# Altium project UWAAL Telemetry Board.PrjPcb
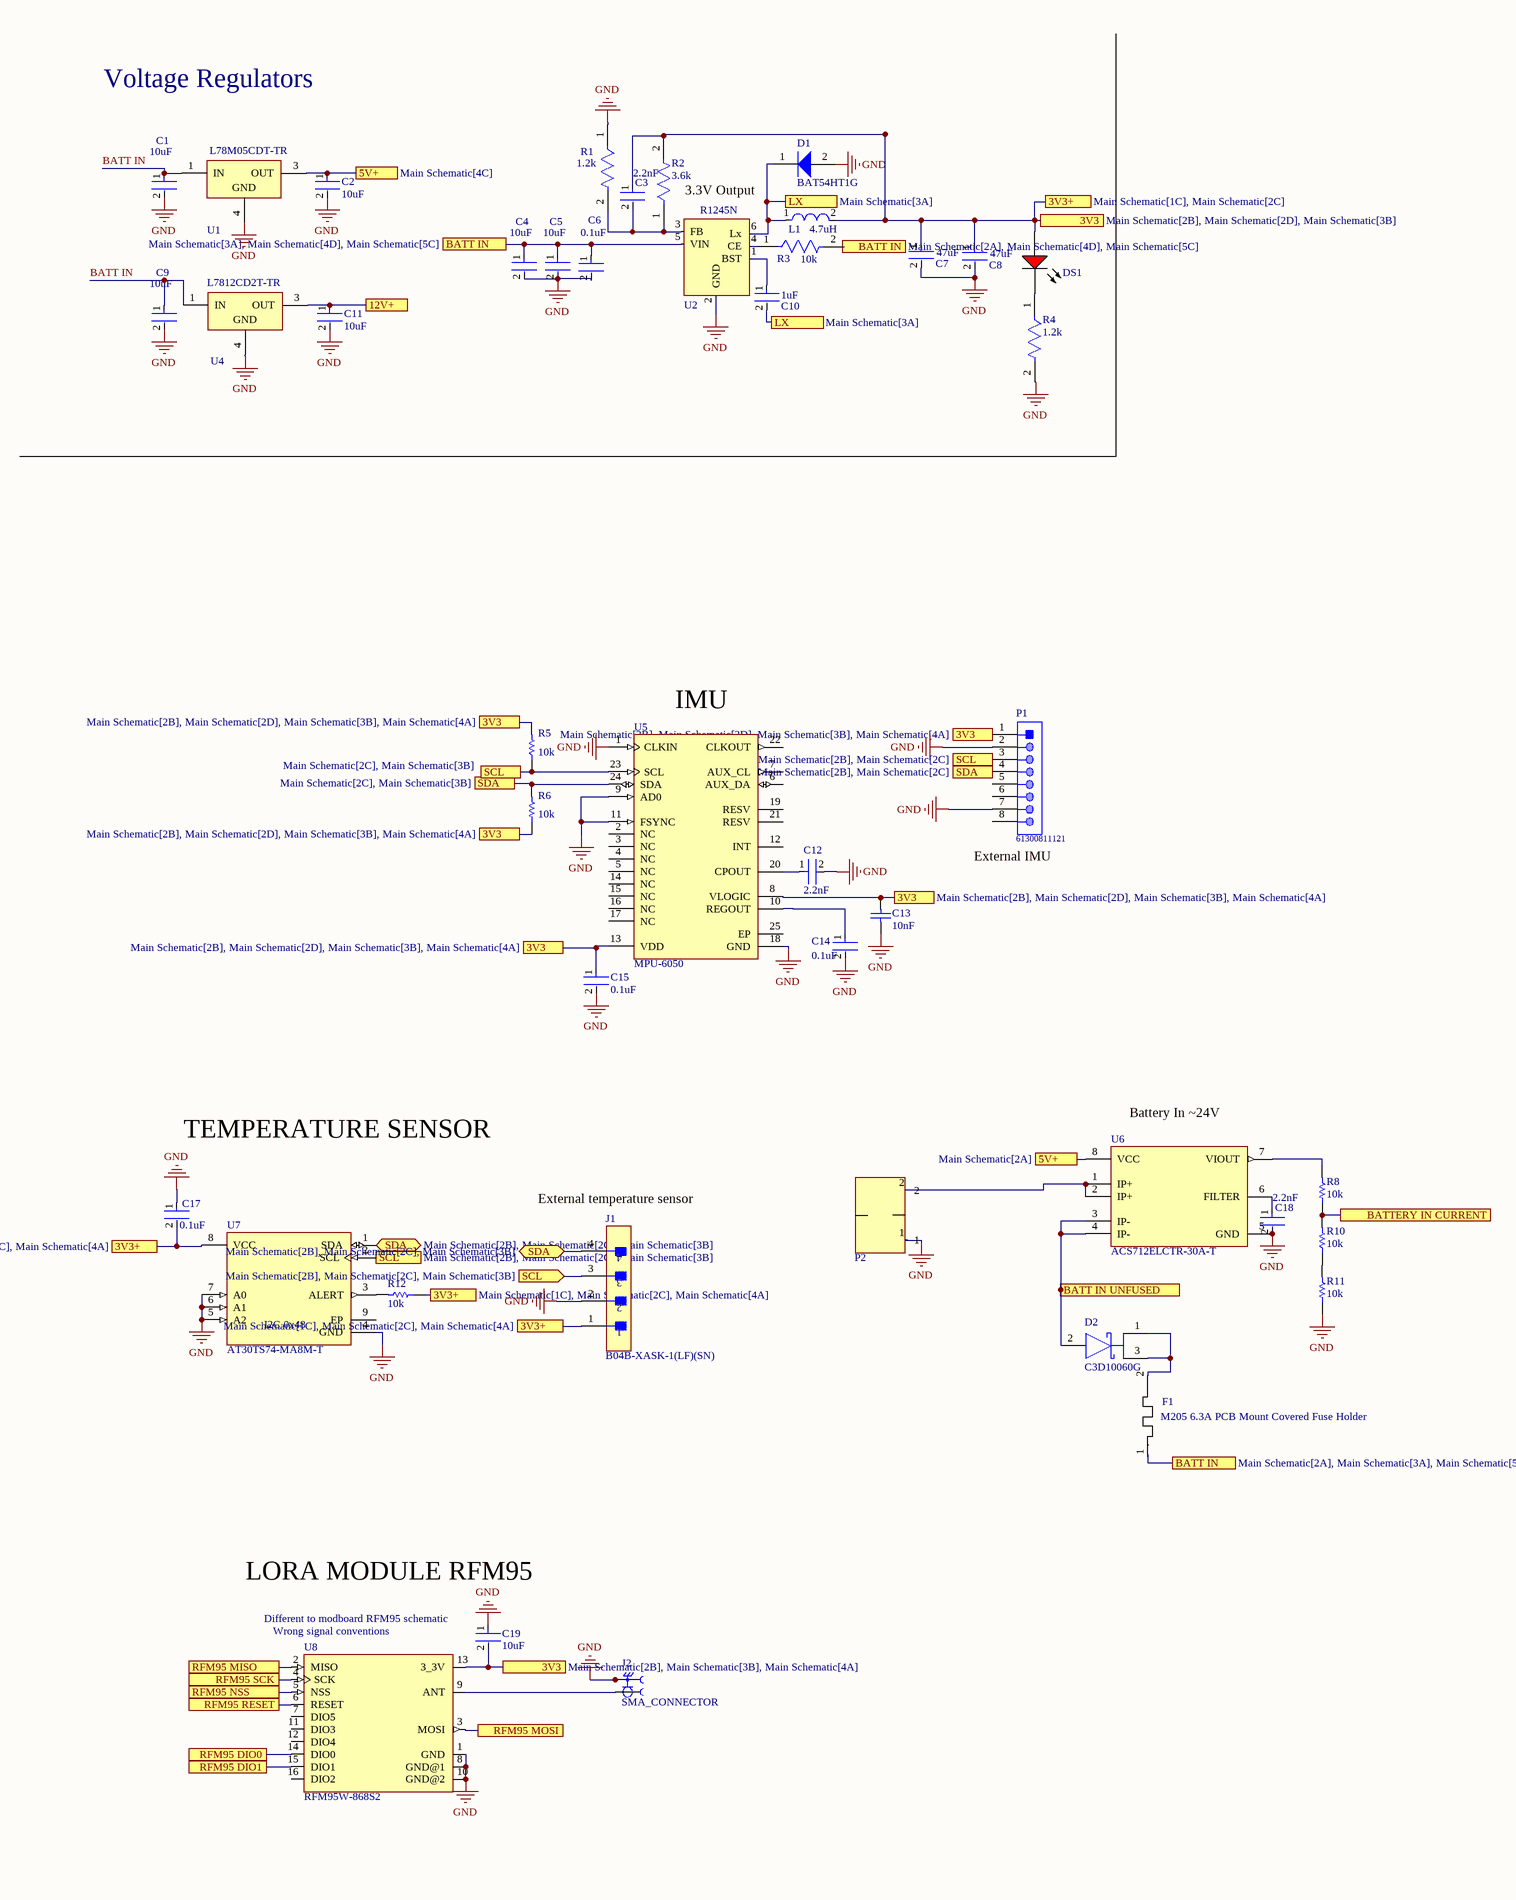
[diagram p0: Main Schematic.SchDoc, left]
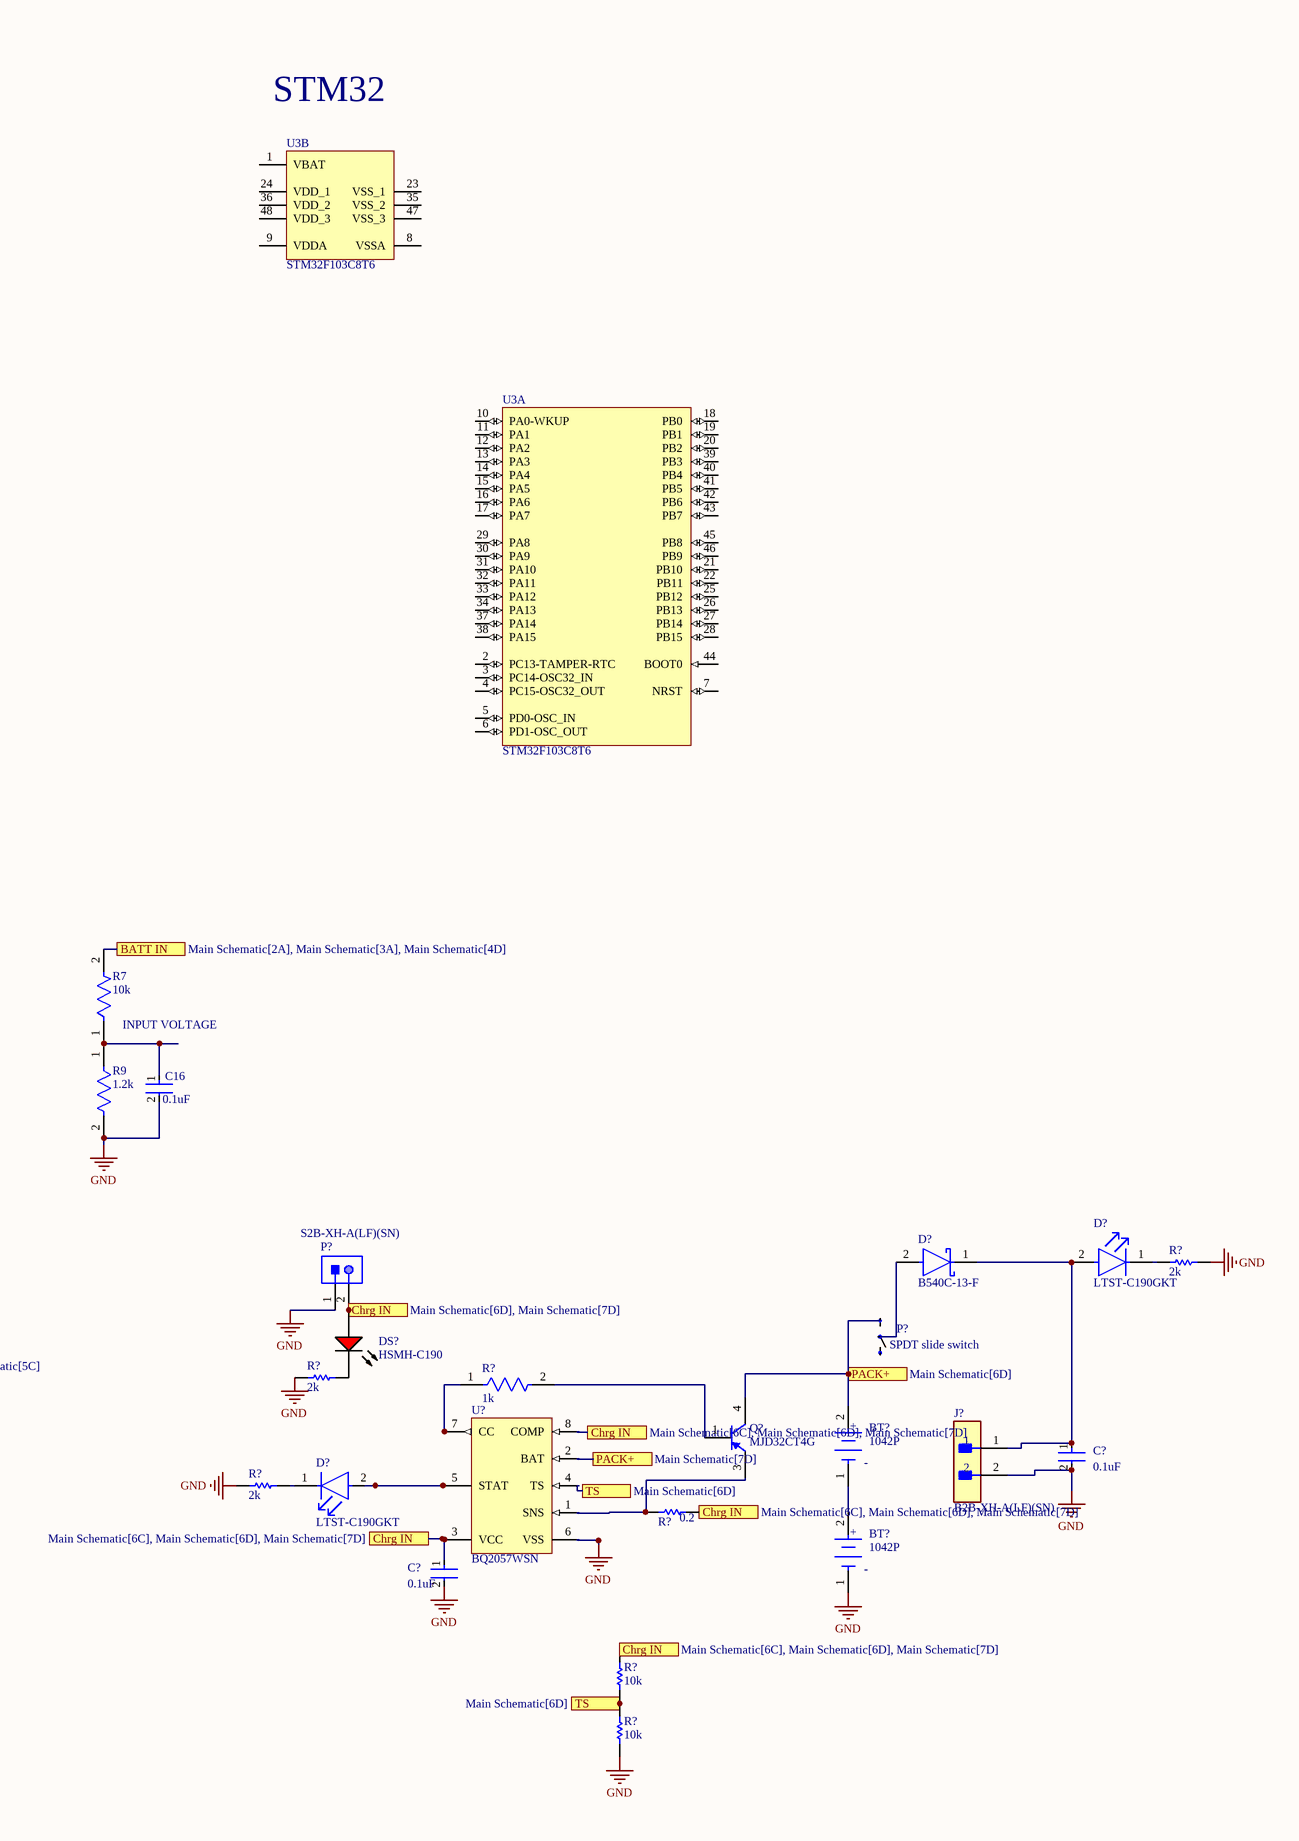
[diagram p1: Main Schematic.SchDoc, right]
1 sheet, 68 parts. Net scope: flat (ports and power ports of the same name join across sheets).
Board file: Main PCB.PcbDoc

## Sheet Main Schematic.SchDoc
size A2; SheetNumber: 1; SheetTotal: 1

### Parts
(Parts that share a designator on the sheet are numbered #1, #2 ... from top to bottom, then left to right.)
BT?#1  1042P  [FP-1042P-MFG]
BT?#2  1042P  [FP-1042P-MFG]
C1  10uF  [FP-2220-L_5_7_0_5-W_5_0_4-IPC_A]
C2  10uF  [FP-GRM188-0_2-MFG]
C3  2.2nF  [FP-0603-L_1_6_0_15-W_0_81-IPC_C]
C4  10uF  [FP-2220-L_5_7_0_5-W_5_0_4-IPC_A]
C5  10uF  [FP-2220-L_5_7_0_5-W_5_0_4-IPC_A]
C6  0.1uF  [FP-C0603-CJ-MFG]
C7  47uF  [FP-C0805C476M9PACTU-MFG]
C8  47uF  [FP-C0805C476M9PACTU-MFG]
C9  10uF  [FP-2220-L_5_7_0_5-W_5_0_4-IPC_A]
C10  1uF  [FP-0603-L_1_6_0_1-W_0_8_0-IPC_A]
C11  10uF  [FP-GRM188-0_2-MFG]
C12  2.2nF  [FP-0603-L_1_6_0_15-W_0_81-IPC_C]
C13  10nF  [CAPC1608X90X35ML10T15]
C14  0.1uF  [FP-C0603C-CF-MFG]
C15  0.1uF  [FP-C0603C-CF-MFG]
C16  0.1uF  [FP-C0603-CJ-MFG]
C17  0.1uF  [FP-C0603-CJ-MFG]
C18  2.2nF  [FP-0603-L_1_6_0_15-W_0_81-IPC_C]
C19  10uF  [FP-GRM188-0_1-e0_2_0_55-IPC_A]
C?#1  0.1uF  [FP-C0603C-CF-MFG]
C?#2  0.1uF  [FP-C0603C-CF-MFG]
D1  BAT54HT1G  [ONSC-SOD-323-2-477-02_V]
D2  C3D10060G  [FP-TO-263-2_v1-MFG]
D?#1  B540C-13-F  [FP-SMC-MFG]
D?#2  LTST-C190GKT  [FP-LTST-C190GKT-MFG]
D?#3  LTST-C190GKT  [FP-LTST-C190GKT-MFG]
DS1  TLMS1000-GS08  [VISH-TLMS1000_V]  (value not drawn)
DS?  HSMH-C190  [AVAG-HSMX-C190_V]
F1  M205 6.3A PCB Mount Covered Fuse Holder  [M205 6.3A PCB Mount Covered Fuse Holder-Footprint-1]
J1  B04B-XASK-1(LF)(SN)  [FP-B04B-XASK-1_LF_SN-MFG]
J2  SMA_CONNECTOR  [LPRS_SMA_CONNECTOR]
J?  B2B-XH-A(LF)(SN)  [FP-B2B-XH-A_LF_SN-MFG]
L1  4.7uH  [FP-IHLP-2525BD-FP_2_413x3-MFG]
P1  61300811121  [61300811121]
P2  Barrier Block Screw Terminal 2 Way  [Barrier Block Screw Terminal 2 Way-Footprint-1]  (value not drawn)
P?#1  S2B-XH-A(LF)(SN)  [JST-S2B-XH-A(LF)(SN)_V]
P?#2  SPDT slide switch  [Horizontal SPDT 5A slide switch-Footprint-1]
Q?  MJD32CT4G  [ONSC-DPAK-3-369C-01_V]
R1  1.2k  [FP-CRCW0603-e3-MFG]
R2  3.6k  [FP-CRCW0603-e3-IPC_A]
R3  10k  [FP-ERA3A-IPC_C]
R4  1.2k  [FP-CRCW0603-e3-MFG]
R5  10k  [RESC1609X50X30NL8T20]
R6  10k  [RESC1609X50X30NL8T20]
R7  10k  [FP-ERA3A-IPC_C]
R8  10k  [RESC1609X50X30NL8T20]
R9  1.2k  [FP-CRCW0603-e3-MFG]
R10  10k  [RESC1609X50X30NL8T20]
R11  10k  [RESC1609X50X30NL8T20]
R12  10k  [RESC1609X50X30NL8T20]
R?#1  2k  [RESC1609X50X30ML10T20]
R?#2  2k  [RESC1609X50X30ML10T20]
R?#3  1k  [FP-CRCW0603-e3-MFG]
R?#4  2k  [RESC1609X50X30ML10T20]
R?#5  0.2  [RESC3216X89X51ML25T25]
R?#6  10k  [RESC1609X50X30NL8T20]
R?#7  10k  [RESC1609X50X30NL8T20]
U1  L78M05CDT-TR  [TO-252_L]
U2  R1245N  [SOT95P280X100-6N]
U3  STM32F103C8T6  [STM-LQFP48_L]  (parts A,B of 2)
U4  L7812CD2T-TR  [TO-263_M]
U5  MPU-6050  [IS-QFN-24_V]
U6  ACS712ELCTR-30A-T  [FP-LC-8-IPC_C]
U7  AT30TS74-MA8M-T  [FP-8MA2-MFG]
U8  RFM95W-868S2  [XCVR_RFM95W-868S2]
U?  BQ2057WSN  [D0008A_N]

### Ports
3V3 (see Main Schematic[2B], Main Schematic[2D], Main Schematic[3B]), 3V3 (see Main Schematic[2B], Main Schematic[2D], Main Schematic[3B], Main Schematic[4A]), 3V3 (see Main Schematic[2B], Main Schematic[3B], Main Schematic[4A]), 3V3+ (see Main Schematic[1C], Main Schematic[2C]), 3V3+ (see Main Schematic[1C], Main Schematic[2C], Main Schematic[4A]), 3V3+ (see Main Schematic[2C], Main Schematic[4A]), 5V+ (see Main Schematic[2A]), 5V+ (see Main Schematic[4C]), 12V+, BATT IN (see Main Schematic[2A], Main Schematic[3A], Main Schematic[4D]), BATT IN (see Main Schematic[2A], Main Schematic[3A], Main Schematic[5C]), BATT IN (see Main Schematic[2A], Main Schematic[4D], Main Schematic[5C]), BATT IN (see Main Schematic[3A], Main Schematic[4D], Main Schematic[5C]), BATT IN UNFUSED, BATTERY IN CURRENT, Chrg IN (see Main Schematic[6C], Main Schematic[6D], Main Schematic[7D]), Chrg IN (see Main Schematic[6D], Main Schematic[7D]), LX (see Main Schematic[3A]), PACK+ (see Main Schematic[6D]), PACK+ (see Main Schematic[7D]), RFM95 DIO0, RFM95 DIO1, RFM95 MISO, RFM95 MOSI, RFM95 NSS, RFM95 RESET, RFM95 SCK, SCL (in, see Main Schematic[2B], Main Schematic[2C], Main Schematic[3B]), SCL (see Main Schematic[2B], Main Schematic[2C]), SCL (see Main Schematic[2C], Main Schematic[3B]), SDA (bidir, see Main Schematic[2B], Main Schematic[2C], Main Schematic[3B]), SDA (see Main Schematic[2B], Main Schematic[2C]), SDA (see Main Schematic[2C], Main Schematic[3B]), TS (see Main Schematic[6D])

### Nets
GND: BT?#2.1(C) C1.2 C2.2 C4.2 C5.2 C6.2 C7.2 C8.2 C9.2 C11.2 C12.2 C13.1 C14.2 C15.2 C16.2 C17.1 C18.2 C19.1 C?#1.2 C?#2.2 D1.2(A) J1.2 J2.G1 J2.G2 J2.G3 J2.G4 J?.2 P1.2 P1.7 P2.1 P?#1.1 R1.1 R4.2 R9.2 R11.1 R?#1.1 R?#2.1 R?#4.1 R?#7.1 U1.4(GND) U2.2(GND) U4.4(GND) U5.1(CLKIN) U5.9(AD0) U5.11(FSYNC) U5.18(GND) U6.5(GND) U7.4(GND) U7.5(A2) U7.6(A1) U7.7(A0) U8.1(GND) U8.8(GND@1) U8.10(GND@2) U?.6(VSS)
BATT IN: C1.1 C9.1 U1.1(IN) U4.1(IN)
NetBT?#1_1: BT?#1.1(C) BT?#2.2(A)
NetBT?#1_2: BT?#1.2(A) P?#2.1 Q?.4(C) U?.2(BAT) ; port PACK+
NetC2_1: C2.1 U1.3(OUT) U6.8(VCC) ; port 5V+
NetC3_1: C3.1 C7.1 C8.1 C13.2 C15.1 C17.2 C19.2 DS1.1(A) J1.1 L1.2 P1.1 R2.2 R5.2 R6.1 R12.1 U5.8(VLOGIC) U5.13(VDD) U7.8(VCC) U8.13(3_3V) ; port 3V3+, port 3V3
NetC3_2: C3.2 R1.2 R2.1 U2.3(FB)
NetC4_1: C4.1 C5.1 C6.1 F1.1 R3.2 R7.2 U2.5(VIN) ; port BATT IN
NetC10_1: C10.1 U2.1(BST)
NetC10_2: C10.2 D1.1(K) L1.1 U2.6(Lx) ; port LX
NetC11_1: C11.1 U4.3(OUT) ; port 12V+
NetC12_1: C12.1 U5.20(CPOUT)
NetC14_1: C14.1 U5.10(REGOUT)
NetC16_1: C16.1 R7.1 R9.1
NetC18_1: C18.1 U6.6(FILTER)
NetC?#1_1: C?#1.1 D?#1.1(C) D?#2.2(A) J?.1
NetC?#2_1: C?#2.1 DS?.1(A) P?#1.2 R?#5.2 R?#6.2 U?.3(VCC) U?.8(COMP) ; port Chrg IN
NetD2_1: D2.1(C) D2.3(C) F1.2
NetD2_2: D2.2(A) U6.3(IP-) U6.4(IP-) ; port BATT IN UNFUSED
NetD?#1_2: D?#1.2(A) P?#2.2
NetD?#2_1: D?#2.1(C) R?#1.2
NetD?#3_1: D?#3.1(C) R?#4.2
NetD?#3_2: D?#3.2(A) U?.5(STAT)
NetDS1_2: DS1.2(K) R4.1
NetDS?_2: DS?.2(K) R?#2.2
NetJ1_3: J1.3 P1.3 R5.1 U5.23(SCL) U7.2(SCL) ; port SCL
NetJ1_4: J1.4 P1.4 R6.2 U5.24(SDA) U7.1(SDA) ; port SDA
NetJ2_1: J2.1 U8.9(ANT)
NetP2_2: P2.2 U6.1(IP+) U6.2(IP+)
NetQ?_1: Q?.1(B) R?#3.2
NetQ?_3: Q?.3(E) R?#5.1 U?.1(SNS)
NetR3_1: R3.1 U2.4(CE)
NetR8_1: R8.1 R10.2 ; port BATTERY IN CURRENT
NetR8_2: R8.2 U6.7(VIOUT)
NetR10_1: R10.1 R11.2
NetR12_2: R12.2 U7.3(ALERT)
NetR?#3_1: R?#3.1 U?.7(CC)
NetR?#6_1: R?#6.1 R?#7.2 U?.4(TS) ; port TS
NetU8_2: U8.2(MISO) ; port RFM95 MISO
NetU8_3: U8.3(MOSI) ; port RFM95 MOSI
NetU8_4: U8.4(SCK) ; port RFM95 SCK
NetU8_5: U8.5(NSS) ; port RFM95 NSS
NetU8_6: U8.6(RESET) ; port RFM95 RESET
NetU8_14: U8.14(DIO0) ; port RFM95 DIO0
NetU8_15: U8.15(DIO1) ; port RFM95 DIO1

Not connected (* = marked no-connect by the designer): P1 5 6 8; P?#2 3(16); U3 1(VBAT) 2(PC13-TAMPER-RTC) 3(PC14-OSC32_IN) 4(PC15-OSC32_OUT) 5(PD0-OSC_IN) 6(PD1-OSC_OUT) 7(NRST) 8(VSSA) 9(VDDA) 10(PA0-WKUP) 11(PA1) 12(PA2) 13(PA3) 14(PA4) 15(PA5) 16(PA6) 17(PA7) 18(PB0) 19(PB1) 20(PB2) 21(PB10) 22(PB11) 23(VSS_1) 24(VDD_1) 25(PB12) 26(PB13) 27(PB14) 28(PB15) 29(PA8) 30(PA9) 31(PA10) 32(PA11) 33(PA12) 34(PA13) 35(VSS_2) 36(VDD_2) 37(PA14) 38(PA15) 39(PB3) 40(PB4) 41(PB5) 42(PB6) 43(PB7) 44(BOOT0) 45(PB8) 46(PB9) 47(VSS_3) 48(VDD_3); U5 2(NC) 3(NC) 4(NC) 5(NC) 6(AUX_DA) 7(AUX_CL) 12(INT) 14(NC) 15(NC) 16(NC) 17(NC) 19(RESV) 21(RESV) 22(CLKOUT) 25(EP); U7 9(EP); U8 7(DIO5) 11(DIO3) 12(DIO4) 16(DIO2)

### Notes on the sheet
- Voltage Regulators
- 3.3V Output
- STM32
- (near U5) IMU
- (near P1) External IMU
- (near U5) I2C 0x68
- TEMPERATURE SENSOR
- (near U6) Battery In ~24V
- (near R7) INPUT VOLTAGE
- (near J1) External temperature sensor
- (near U7) I2C 0x48
- (near C19) LORA MODULE RFM95
- (near C19) Different to modboard RFM95 schematic
- (near U8) Wrong signal conventions
- (in symbol CMP-19636-000019-1) +; -

### Library data of the parts
BT?#1 BT?#2 = CMP-19636-000019-1: BATTERY HOLDER 18650 SMD TAB; Number of Cells: 1; Max Operating Temperature: 145°C; Termination: SMD/SMT; Mount: Surface Mount; Min Operating Temperature: -50°C; Package Quantity: 200; Packaging: Tray; Lead Free: Lead Free
C1 C4 C5 C9 = CMP-04427-001477-1: General Purpose Ceramic Capacitor, 2220, 10uF, 10%, X7R, 15%, 50V 22205C106KAT2A; Dissipation Factor: 2.5%; Tolerance: 10%; Depth: 5mm; Thickness: 0.11inch; Construction: Flat; REACH SVHC: No SVHC; Length: 5.7mm; Voltage Rating (DC): 50V; Contact Plating: Tin; Capacitance: 10uF; Radiation Hardening: No; Packaging: Tape and Reel; Height: 2.79mm; Width: 0.197inch; Dielectric: X7R; Case Code (Imperial): 2220; Package Quantity: 500; Max Operating Temperature: 125°C; Case/Package: 2220; Voltage: 50V; Voltage Rating: 50V; Number of Pins: 2; Case Code (Metric): 5750; Lead Free: Lead Free; Series: Standard; Termination: SMD/SMT; RoHS Compliant: Yes; Mount: Surface Mount; Min Operating Temperature: -55°C
C2 C11 = CMP-2006-02520-2: Chip Multilayer Ceramic Capacitors for General Purpose, 0603, 10uF, X5R, 15%, 20%, 25V; Tolerance: 20%; Resistor Type: Ceramic; Voltage: 25V; Max Operating Temperature: 85°C; Min Operating Temperature: -55°C; Capacitance: 10uF; Dielectric: X5R; Lead Free: Lead Free; REACH SVHC: No SVHC; Case/Package: 0603; Mount: Surface Mount; Voltage Rating (DC): 25V; Height: 0.8mm; Length: 1.6mm; Thickness: 0.031inch; Width: 0.031inch; Termination: SMD/SMT; Case Code (Imperial): 0603; Case Code (Metric): 1608; Package Quantity: 1; Packaging: Tape and Reel; Depth: 0.8mm; Voltage Rating: 25V; Weight: 0.000222oz; Number of Pins: 2
C3 C12 C18 = CMP-2006-02056-2: General Purpose Ceramic Capacitor, 0603, 2.2nF, 5%, X7R, 15%, 50V 06035C222JAT2A; Dissipation Factor: 2.5%; Termination: SMD/SMT; Capacitance: 2.2nF; Length: 1.6mm; Height: 0.9mm; Case Code (Metric): 1608; Width: 0.81mm; Case/Package: 0603; Lead Free: Lead Free; Max Operating Temperature: 125°C; Package Quantity: 1; Tolerance: 5%; Radiation Hardening: No; Voltage Rating: 50V; Series: -; Dielectric: X7R; Voltage: 50V; REACH SVHC: No SVHC; Voltage Rating (DC): 50V; Thickness: 0.035inch; Packaging: Tape and Reel; Case Code (Imperial): 0603; Min Operating Temperature: -55°C; Construction: Flat; RoHS Compliant: Yes; Mount: Surface Mount; Depth: 0.81mm
C6 C16 C17 = CMP-2006-03300-2: CAP CER 0.1UF 50V X7R 0603 C0603X104K5RACTU; Manufacturer: Kemet; Capacitance: 100nF; Material: Ceramic; Tolerance: 10%; Value: 100nF; Temperature Coefficient: 15%; Temperature Range High: +125°C; Temperature Range Low: -55°C; Manufacturer Part Number: C0603X104K5RACTU; Voltage: 50V; ComponentLink2Description: Datasheet; RoHS: TRUE; ComponentLink2URL: https://content.kemet.com/datasheets/KEM_C1013_X7R_FT-CAP_SMD.pdf; Device Class L3: Ceramic Capacitors; Device Class L2: Capacitors; Package: C0603-CJ; Height: 0.95mm; Device Class L1: Passive Components; Temperature Characteristic: X7R; Lead Free: Yes; Digikey Description: CAP CER 0.1UF 50V X7R 0603; Automotive: No; Mouser Description: Capacitor; Ceramic; Cap 0.1uF; Tol+10%; SMT; Flexible Termination; Vol-Rtg 50V; TR; Temperature: -55°C to +125°C; Octopart: https://octopart.com/c0603x104k5ractu-kemet-9145062; Category: Cap; Voltage Rating: 50V; Ipc Land Pattern Name: CAPC16080X80
C7 C8 = CMP-2007-01008-2: CAP CER 47UF 6.3V X5R 0805; Dielectric Material: Ceramic; Dissipation Factor: 5%; Tolerance: 20%; Case Code (Imperial): 0805; Mount: PCB; Width: 1.2mm; Package Quantity: 3000; Radiation Hardening: No; Packaging: Tape and Reel; Termination: SMD/SMT; Series: C0805C; Voltage: 6.3V; Depth: 1.25mm; Dielectric: X5R; Case Code (Metric): 2012; Length: 2mm; Case/Package: 0805; REACH SVHC: No SVHC; Voltage Rating (DC): 6.3V; Capacitance: 47uF; RoHS Compliant: Yes; Height: 1.25mm; Construction: Flat; Number of Pins: 2; Voltage Rating: 6.3V; Max Operating Temperature: 85°C; Min Operating Temperature: -55°C
C10 = CMP-2000-05447-3: UMK107BJ105KA-T; Tolerance: 10%; Voltage Rating: 50V; Dielectric: X5R; Height: 0.8mm; Depth: 0.8mm; Number of Pins: 2; Length: 1.6mm; Thickness: 0.035inch; Contact Plating: Nickel; Radiation Hardening: No; Package Quantity: 1; Case/Package: 0603; Capacitance: 1uF; Halogen Free: Halogen Free; RoHS Compliant: Yes; Termination: SMD/SMT; Max Operating Temperature: 85°C; Min Operating Temperature: -55°C; Case Code (Metric): 1608; Construction: Flat; Voltage Rating (DC): 50V; Packaging: Tape and Reel; Series: M; Case Code (Imperial): 0603; Width: 0.031inch; Mount: Surface Mount
C13 = CMP-2100-03642-1: Chip Capacitor, 10 nF, +/- 10%, 50 V, -55 to 125 degC, 0603 (1608 Metric), RoHS, Tape and Reel; Manufacturer: Murata; Insulation Resistance: 10GR; Dielectric: X7R; Voltage Rating: 50V; Material: Ceramic; Package Quantity: 1; Lead Free: LeadFree; Case/Package: 0603; Termination: SMD/SMT; REACH SVHC: Unknown; Manufacturer URL: http://www.murata.com/; Datasheet URL: http://search.murata.co.jp/Ceramy/image/img/A01X/G101/ENG/GRM188R71H103KA01-01.pdf; Mount: SurfaceMount; Datasheet Version: 42401.0; Number of Pins: 2; Length: 1.6mm; Voltage: 50V; Depth: 0.8mm; Tolerance: 10%; Min Operating Temperature: -55degC; Voltage Rating (DC): 50V; Max Operating Temperature: 125degC; Package Description: 2-Pin Surface Mount Device, Body 1.6 x 0.8 mm; RoHSCompliant: True; Case Code (Imperial): 0603; Width: 0.031inch; Case Code (Metric): 1608; Height: 0.8mm; Package Reference: 0603; Packaging: TapeandReel; Thickness: 0.035inch; Capacitance: 10nF; Dielectric Material: Ceramic
C14 C15 C?#1 C?#2 = CMP-2006-03061-2: CAP CER 0.1UF 50V X7R 0603; Manufacturer: KEMET; Manufacturer Part Number: C0603C104K5RACTU; Tolerance: 0.1; Temperature Coefficient: 30ppm/°C; Material: Ceramic; Automotive Grade: Grade 1; Value: 0.10 μF; Temperature: -55°C to +125°C; RoHS: TRUE; Temperature Range High: +125°C; Lead Free: Yes; Octopart: https://octopart.com/c0603c104k5ractu-kemet-139244; Digikey Description: CAP CER 0.1UF 50V X7R 0603; Category: Cap; Package: C0603C-CF; ComponentLink2Description: Datasheet; Temperature Range Low: -55°C; Device Class L1: Passive Components; Voltage Rating: 50 V; Automotive: Yes; Device Class L3: Ceramic Capacitors; ComponentLink2URL: https://api.kemet.com/component-edge/download/datasheet/C0603C100J5GACAUTO.pdf; Capacitance: 0.10 μF; Device Class L2: Capacitors; Temperature Characteristic: X7R; Height: 0.87mm
C19 = CMP-2006-02792-2: Chip Multilayer Ceramic Capacitors for General Purpose, 0603, 10uF, X5R, 15%, 20%, 6.3V; Packaging: Tape and Reel; Voltage Rating (DC): 6.3V; Width: 0.031inch; Termination: SMD/SMT; Dielectric: X5R; Package Quantity: 4000; Voltage Rating: 6.3V; Capacitance: 10uF; Case/Package: 0603; Min Operating Temperature: -55°C; Voltage: 6.3V; Length: 1.6mm; Thickness: 0.035inch; Lead Free: Lead Free; Depth: 0.8mm; Case Code (Imperial): 0603; Max Operating Temperature: 85°C; Material: Ceramic; Height: 0.8mm; Tolerance: 20%; Mount: Surface Mount; REACH SVHC: No SVHC; Radiation Hardening: No; Case Code (Metric): 1608
D1 = CMP-1055-00462-1: Schottky Barrier Diode, 2-Pin SOD-323, Pb-Free, Tape and Reel; Manufacturer: On Semiconductor; Configuration: Single; trr Max (ns): 5; IFSM Max (A): 0.6; ComponentLink3URL: http://www.onsemi.com/pub_link/Collateral/477-02.PDF.1; PackageDescription: 2-Pin SOD, Body 1.7 x 1.25 mm; ComponentLink2URL: http://www.onsemi.cn/pub_link/Collateral/BAT54HT1-D.PDF; ComponentLink3Description: Package Specification; ComponentLink2Description: Datasheet; DatasheetVersion: Rev. 6; PackageReference: SOD-323-2-477-02; RoHS: TRUE; ComponentLink1URL: http://www.onsemi.com/; Packing: Tape and Reel; PartNumber: BAT54HT1G; Mounting Technology: Surface Mount; ComponentLink1Description: Manufacturer URL; PackageVersion: Rev. H, 03/2007
D2 = CMP-240925-000042-1: DIODE SCHOTTKY 600V 10A TO263-2; Max Reverse Current: 50uA; Max Power Dissipation: 136.3W; Max Surge Current: 250A; Reverse Recovery Time: 0ns; Forward Current: 14A; Element Configuration: Single; Max Forward Surge Current (Ifsm): 90A; Forward Voltage: 1.8V; Package Quantity: 50; Width: 10.312mm; Min Operating Temperature: -55°C; Max Reverse Voltage (DC): 600V; Radiation Hardening: No; Max Reverse Leakage Current: 50uA; Packaging: Rail/Tube; Height: 4.572mm; Length: 11.05mm; Max Operating Temperature: 175°C; Mount: Surface Mount; Case/Package: TO-263; Series: Z-Rec™; Peak Non-Repetitive Surge Current: 250A; Number of Pins: 2; Max Repetitive Reverse Voltage (Vrrm): 600V; Average Rectified Current: 10A; RoHS Compliant: Yes
D?#1 = CMP-2000-05097-3: DIODE SCHOTTKY 40V 5A SMC; Manufacturer: Diodes Inc.; Automotive Grade: NA; Peak Reverse Current: 0.5mA; Value: 300pF; Max Junction Temp: +150°C; Max Surge Forward Current: 100A; Standoff Height: 0.1mm; Digikey Description: DIODE SCHOTTKY 40V 5A SMC; Temperature Range Low: -55°C; Manufacturer Part Number: B540C-13-F; Octopart: https://octopart.com/b540c-13-f-diodes+inc.-325873; Lead Free: Yes; Reverse Voltage: 40V; RoHS: TRUE; Category: Diode; Mouser Description: Diode: Schottky rectifying; SMD; 40V; 5A; SMC; Package: reel, tape; ComponentLink2Description: Datasheet; Temperature Range High: +150°C; Automotive: No; Footprint Url: https://www.diodes.com/assets/Package-Files/SMC.pdf; Device Class L3: Schottky Diodes; Height: 2.5mm; Forward Current: 5A; Temperature: -55°C to +150°C; Package: SMC; ComponentLink2URL: https://www.diodes.com/assets/Datasheets/ds13012.pdf; Device Class L2: Diodes; Max Repetitive Reverse Voltage: 40V; Device Class L1: Discrete Semiconductors; Capacitance: 300pF
D?#2 D?#3 = CMP-22017-000005-2: LED GREEN CLEAR CHIP SMD; Dominant Wavelength: 569nm; Reverse Voltage: 5V; Lens Color: Colorless; Viewing Angle: 130°; Voltage: 2V; Forward Current: 30mA; Power Dissipation: 100mW; Luminous Intensity: 6mcd; Number of LEDs: 1; Forward Voltage: 2.1V; Wavelength: 565nm; Test Current: 10mA; Min Operating Temperature: -55°C; Lens Style: Clear; Mount: Surface Mount; Width: 0.8mm; Packaging: Tape and Reel; Lens Transparency: Clear; Case Code (Metric): 1608; Depth: 0.8mm; Case Code (Imperial): 0603; Case/Package: 0603; Number of Pins: 2; Max Operating Temperature: 85°C; Lead Free: Lead Free; Number of Elements: 1; Length: 1.6mm; Height: 0.8mm; Package Quantity: 1; Power Rating: 100mW; Radiation Hardening: No; Illumination Color: Green; Color: Green
DS1 = CMP-2000-07254-1: Low Current LED, 40 mW, 1.8 V, -40 to 100 degC, 2-Pin SMD (0603), RoHS, Tape and Reel; Manufacturer: Vishay; Lens Shape: Rectangular; Automotive Qualification Standard: AEC-Q100; Wavelength Typ: 636nm; SVHC: ToBeAdvised; LED Colour: Red; Bulb Size: 1.6mmx0.8mm; Forward Voltage: 1.8V; Luminous Intensity: 4mcd; Forward Current If: 2mA; Viewing Angle: 80°; Datasheet Version: Rev. 1.7, 02/2011; Datasheet URL: https://datasheet.ciiva.com/5798/1698881-5798337.pdf; LED Mounting: SMD; Packaging: CutTape; Package Reference: TLMS1000; Manufacturer URL: http://www.vishay.com/; Mounting Technology: SurfaceMount; Product Range: -; Package Description: 2-Pin Surface Mount Device, Body 1.6 x 0.8 mm; MSL: MSL2-1year
DS? = CMP-1744-00004-1: LED Uni-Color Red, 65 mW, 20 mA, -40 to 85 degC, 2-Pin SMD, RoHS, Tape and Reel; Connector Type: USB; Gender: Male; Current Rating: 1 A; Length: 7.5 mm; Lead Pitch: 0.65 mm; PackageReference: HSMX-C190; Package Quantity: 2000; Max Operating Temperature: 85 degC; PackageDescription: 2-Pin Surface Mount Device, Body 1.6 x 0.8 mm, Height 0.9 mm; ComponentLink3Description: Package Specification; Mount: Surface Mount; Min Operating Temperature: -30 degC; ComponentLink3URL: http://www.fairchildsemi.com/dwg/MA/MA03D.pdf; ComponentLink1Description: Manufacturer URL; Contact Material: Copper; Pins: 5; Width: 5.6 mm; ComponentLink2Description: Datasheet; RoHSCompliant: true; DatasheetVersion: Mar-12; Height: 2.8 mm; Packaging: Tape and Reel; Contact Plating: Gold; ComponentLink1URL: http://www.avagotech.com/; REACH SVHC: No SVHC; ComponentLink2URL: http://docs.avagotech.com/docs/AV02-0551EN
F1 = CMP-00232-3: PCB fuse holder for M205 fuses
J1 = CMP-17439-000018-1: CONN HEADER VERT 4POS 2.5MM; Manufacturer: JST; Current Rating: 3A; Voltage Rating: 250V; Conn Orientation: Straight; Conn Gender: Male; Number Of Contacts: 4; ComponentLink2Description: Datasheet; Package: B04B-XASK-1(LF)(SN); Octopart: https://octopart.com/b04b-xask-1%28lf%29%28sn%29-jst-3990149; Pitch: 2.5mm; Device Class L1: Connectors; RoHS: TRUE; Device Class L3: unset; Manufacturer Part Number: B04B-XASK-1(LF)(SN); Temperature Range High: +85°C; Height: 8.8mm; Lead Free: Yes; Category: Conn; Temperature: -25°C to +85°C; Digikey Description: CONN HEADER VERT 4POS 2.5MM; Temperature Range Low: -25°C; ComponentLink2URL: http://www.jst-mfg.com/product/pdf/eng/eXA1.pdf; Contact Material: Tin,Copper; Device Class L2: Headers and Wire Housings; Automotive: No; Number Of Rows: 1
J2 = SMA_CONNECTOR: Straight SMA Connector; Package: None; MP: SMA_CONNECTOR; Value: *; Price: None; Availability: Unavailable
J? = CMP-2000-05888-3: CONN HEADER VERT 2POS 2.5MM; Current Rating: 3A; Voltage Rating: 250V; Number of Contacts: 2; Contact Resistance: 20mR; Wire/Cable Gauge: 22AWG; Insulation Resistance: 1GR; Connector Type: Male Pin; Packaging: Bulk; Contact Material: Brass; Lead Free: Lead Free; Orientation: Straight; Contact Plating: Tin; Max Current Rating: 3A; Termination: Solder; Fastening Type: Detent; Depth: 5.75mm; Housing Material: Polyamide; REACH SVHC: No SVHC; Series: XH; Voltage Rating (AC): 250V; Number of Positions: 2; Color: Natural; Contact Type: Male Pin; Max Voltage Rating (DC): 250V; Pitch: 2.5mm; Lead Pitch: 2.5mm; Mount: Through Hole; Max Operating Temperature: 85°C; Length: 7.4mm; Max Voltage Rating (AC): 250V; Min Operating Temperature: -25°C; Number of Rows: 1; Housing Color: White
L1 = CMP-02424-000271-1: Commercial Inductors, High Saturation Series 4.5A 63mΩ 20% IHLP2525BDER4R7M01; Self Resonant Frequency: 5MHz; DC Resistance (DCR): 63mR; Max DC Current: 10A; Core Material: Metal; Test Frequency: 100kHz; Shielding: Shielded; Radiation Hardening: No; Number of Pins: 2525; Tolerance: 20%; Termination: SMD/SMT; Depth: 6.72mm; Military Standard: Not; Max Operating Temperature: 125°C; Min Operating Temperature: -55°C; RMS Current (Irms): 4.5A; Width: 6.47mm; Saturation Current: 10A; Height: 2.4mm; Inductance: 4.7uH; Case/Package: 2525; Packaging: Tape and Reel; Current Rating: 4.5A; Length: 6.86mm; Inductance Tolerance: 20%; Package Quantity: 2000; Lead Free: Lead Free; Height - Seated (Max): 0.094inch; Mount: Surface Mount
P1 = CMP-1502-01076-1: THT Vertical Pin Header WR-PHD, Pitch 2.54 mm, Single Row, 8 pins; Manufacturer: Wurth Elektronik; Rated Current: 3A; Pin Number: 8; Working Voltage: 250VAC; Gender: Male; Contact Resistance: 20mOhm; Pitch: 2.54mm; Withstanding Voltage: 500VAC; Publisher: WurthElektronik; Operating Temperature: -40to105degC; Orientation: Vertical; Row Number: Single; Part Number: 61300811121; Package Reference: 61300811121; Mounting Technology: THT; Packaging: Bag; Manufacturer URL: http://www.we-online.de; Datasheet URL: https://katalog.we-online.de/em/datasheet/6130xx11121.pdf
P2 = CMP-00320-1: Screw Terminal Block 2 Way Through Hole
P?#1 = CMP-1755-00005-1: Male Header, Pitch 2.5 mm, 1 x 2 Position, Height 6.1 mm, Tail Length 3.4 mm, -25 to 85 degC, RoHS, Bulk; Type (Capacitors): X7R; Voltage Rating (DC): 100 V; Tolerance: 10%; Capacitance: 1 nF; Case\Package: Radial; Min Operating Temperature: -55 degC; Mount: Through Hole; Package Quantity: 500; PackageReference: S2B-XH-A(LF)(SN); ComponentLink1Description: Manufacturer URL; Max Operating Temperature: 125 degC; ComponentLink2Description: Datasheet; RoHSCompliant: true; PackageDescription: Male Header, Pitch 2.5 mm, 1 x 2 Position, Height 6.1 mm, Tail Length 3.4 mm; REACH SVHC: No SVHC; Packaging: Bulk; Width: 3.81 mm; Length: 5.33 mm; Height: 2.54 mm; Pins: 2; Radiation Hardening: No; ComponentLink1URL: http://www.jst.com/home2.html; Lead Pitch: 2.54 mm; DatasheetVersion: May-16; Voltage Rating: 100 V; ComponentLink2URL: http://www.jst-mfg.com/product/pdf/eng/eXH.pdf
P?#2 = CMP-00177-1: 1101M2S3ABE2 1000 series could be 500 series too (same)
Q? = CMP-1048-00197-1: Complementary Power Transistor, 3-Pin DPAK, Pb-Free, Tape and Reel; Manufacturer: On Semiconductor; IC Continuous (A): 3; Polarity: PNP; ComponentLink2Description: Datasheet; PackageVersion: Rev. E, 02/2014; PackageReference: DPAK-3-369C-01; Packing: Tape and Reel; PartNumber: MJD32CT4G; ComponentLink3URL: http://www.onsemi.cn/pub_link/Collateral/369C.PDF; ComponentLink3Description: Package Specification; PackageDescription: 3-Pin Flange Mount, Body 6.54 x 6.095 mm, Pitch 2.29 mm; RoHS: TRUE; ComponentLink1URL: http://www.onsemi.com/; ComponentLink2URL: http://www.onsemi.cn/pub_link/Collateral/MJD31-D.PDF; ComponentLink1Description: Manufacturer URL; DatasheetVersion: Rev. 13; fT Min (MHz): 3; Mounting Technology: Surface Mount
R1 R4 R9 = CMP-2000-02982-2: RES Thick Film, 1.2kΩ, 1%, 0.1W, 100ppm/°C, 0603; Max Power Dissipation: 100mW; Resistance: 1.2kR; Voltage Rating: 75V; Package Quantity: 10; Weight: 7.1E-05oz; Packaging: Tape and Reel; Max Operating Temperature: 155°C; Case/Package: 0603; Case Code (Imperial): 0603; Length: 1.55mm; Width: 0.033inch; Radiation Hardening: No; Power Rating: 100mW; Depth: 0.85mm; Military Standard: Not; Case Code (Metric): 1608; Tolerance: 1%; Termination: SMD/SMT; Temperature Coefficient: 100ppm/°C; Mount: Surface Mount; Min Operating Temperature: -55°C; Lead Free: Lead Free; Contact Plating: Tin; Composition: Thick Film; Voltage Rating (DC): 75V; Features: Automotive AEC-Q200; Height: 0.45mm; Number of Terminations: 2
R2 = CMP-1012-00572-3: RES Thick Film, 3.6kΩ, 1%, 0.1W, 100ppm/°C, 0603 CRCW06033K60FKEA; Max Power Dissipation: 100mW; Voltage Rating (DC): 75V; Resistance: 3.6kR; Temperature Coefficient: 100ppm/°C; Contact Plating: Tin; Package Quantity: 10; Case/Package: 0603; Height: 0.45mm; Length: 1.55mm; Termination: SMD/SMT; Military Standard: Not; Radiation Hardening: No; Min Operating Temperature: -55°C; Features: Automotive AEC-Q200; Tolerance: 1%; Lead Free: Lead Free; Case Code (Imperial): 0603; Max Operating Temperature: 155°C; Packaging: Tape and Reel; Composition: Thick Film; Case Code (Metric): 1608; Number of Terminations: 2; Width: 0.033inch; Weight: 7.1E-05oz; Depth: 0.85mm; Number of Pins: 2; Power Rating: 100mW; Voltage Rating: 75V
R3 R7 = CMP-2000-00874-2: RES SMD 10K OHM 0.1% 1/10W 0603; Voltage Rating (DC): 75V; Power Rating: 100mW; Resistance: 10kR; Temperature Coefficient: 25ppm/°C; Radiation Hardening: No; Width: 0.8mm; Depth: 0.8mm; Construction: Rectangular; Case Code (Metric): 1608; Package Quantity: 5000; Length: 1.6mm; Size Code: 0603; Case Code (Imperial): 0603; Termination: SMD/SMT; Contact Plating: Tin; Resistance Tolerance: 0.1%; Military Standard: Not; Packaging: Tape and Reel; Max Power Dissipation: 100mW; REACH SVHC: No SVHC; Series: ERA-3A; Voltage Rating: 75V; Lead Free: Lead Free; Technology: METAL FILM; RoHS Compliant: Yes; Max Operating Temperature: 155°C; Resistor Type: Thin Film; Min Operating Temperature: -55°C; Number of Pins: 2; Case/Package: 0603; Tolerance: 0.1%; Height: 0.45mm; Mount: Surface Mount; Number of Terminations: 2
R5 R6 R8 R10-R12 R?#6 R?#7 = CMP-1666-00005-4: Chip Resistor, 10 KOhm, +/- 1%, 100 mW, -55 to 155 degC, 0603 (1608 Metric), RoHS, Tape and Reel; Manufacturer: Vishay Semiconductor; Voltage Rating: 75 V; Max Operating Temperature: 155 degC; PackageDescription: 2-Pin Surface Mount Device, Body 1.575 x 0.85 mm; ComponentLink1Description: Manufacturer URL; RoHSCompliant: true; PackageReference: 0603; REACH SVHC: Unknown; Length: 1.55 mm; DatasheetVersion: 06/2012; Packaging: Tape and Reel; Min Operating Temperature: -55 degC; Mounting Technology: Surface Mount; ComponentLink2URL: https://datasheet.ciiva.com/11809/0900766b80d98afc-11809037.pdf; Height: 0.45 mm; ComponentLink2Description: Datasheet; Package Quantity: 5000; ComponentLink1URL: http://www.vishay.com/
R?#1 R?#2 R?#4 = CMP-2000-03159-1: Manufacturer: Vishay Dale; Part Number: CRCW06032K00FKEA
R?#3 = CMP-1666-00003-5: RES Thick Film, 1kΩ, 1%, 0.1W, 100ppm/°C, 0603; Max Power Dissipation: 100mW; Voltage Rating: 75V; Resistance: 1kR; Max Operating Temperature: 155°C; Number of Pins: 2; Case Code (Imperial): 0603; Width: 0.033inch; Power Rating: 100mW; Number of Terminations: 2; Package Quantity: 10; Weight: 7.1E-05oz; Tolerance: 1%; Temperature Coefficient: 100ppm/°C; Military Standard: Not; Mount: Surface Mount; Voltage Rating (DC): 75V; Depth: 0.85mm; Composition: Thick Film; Radiation Hardening: No; Termination: SMD/SMT; Length: 1.55mm; Case Code (Metric): 1608; Contact Plating: Tin; Min Operating Temperature: -55°C; Packaging: Tape and Reel; Height: 0.45mm; Lead Free: Lead Free; Case/Package: 0603; Features: Automotive AEC-Q200
R?#5 = CMP-2003-04372-1: Manufacturer: Vishay Dale; Part Number: WSL1206R2000FEA
U1 = CMP-0244-00178-1: Positive Voltage Regulator, 5V, 3-Pin DPAK, Tape and Reel; PackageReference: TO-252; ComponentLink1URL: http://www.st.com; ComponentLink2Description: Datasheet; PackageDescription: 3-Pin Transistor Outline Package 2.28 mm Pitch, 9.7 mm Lead Span (DPAK); ComponentLink1Description: Manufacturer URL; DatasheetVersion: 1/11/2010; ComponentLink2URL: http://www.st.com/internet/com/TECHNICAL_RESOURCES/TECHNICAL_LITERATURE/DATASHEET/CD00000447.pdf; PackageVersion: 2011
U2 = CMP-00335-1: Switching Voltage Regulators Buck DC/DC Converter
U3 = CMP-0237-00215-3: ARM Cortex-M3 32-bit MCU, 64 KB Flash, 20 KB Internal RAM, 37 I/Os, 48-pin LQFP, -40 to 85 degC, Tray; Supply Voltage(Vcc) min (V): 2; Internal RAM Size (kB): 20; FLASH Size (Prog) (kB): 64; A/D Converter: 2x12-bit (10 Channel); I/Os (High Current): 37; Operating Frequency(F) (Processor speed) (MHz): 72; Core: ARM Cortex-M3; ComponentLink3Description: Package Specification; Mounting Technology: Surface Mount; PartNumber: STM32F103C8T6; PackageReference: LQFP48; Packing: Tray; ComponentLink3URL: http://www.st.com/st-web-ui/static/active/en/resource/technical/document/datasheet/DM00058181.pdf; DatasheetVersion: Rev. 16; ComponentLink1URL: http://www.st.com/web/en/home.html; PackageVersion: Rev. 6, 06/2013; ComponentLink2URL: http://www.st.com/st-web-ui/static/active/en/resource/technical/document/datasheet/CD00161566.pdf; ComponentLink1Description: Manufacturer URL; ComponentLink2Description: Datasheet; PackageDescription: 48-Pin Low Profile Quad Flat Package, 7 x 7 mm Body, 0.5 mm Pitch
U4 = CMP-0244-00182-1: Positive Voltage Regulator, 3-Pin D2PAK, Tape and Reel; PackageDescription: 3-Pin Transistor Outline Package 2.54 mm Pitch, 15.4 mm Lead Span (D2PAK); ComponentLink1Description: Manufacturer URL; PackageReference: TO-263; DatasheetVersion: 16/11/2011; ComponentLink2URL: http://www.st.com/internet/com/TECHNICAL_RESOURCES/TECHNICAL_LITERATURE/DATASHEET/CD00000444.pdf; ComponentLink1URL: http://www.st.com; PackageVersion: 2011; ComponentLink2Description: Datasheet
U5 = CMP-1753-00002-2: 3-Axis Gyroscope, Accelerometer and a Digital Motion Processor(TM) (DMP), 2.375 to 3.46 V, -40 to 85 degC, 24-Pin QFN, RoHS, Tape and Reel; Manufacturer: InvenSense; Featured Product: MPU-60506-Axis,IntegratedI²CSolution; Other Names: 1428-1007-2 / MPU6050; Sensor Type: MotionTracking; Online Catalog: MPU-6000™Series; Unit PriceUSD: Digital; Datasheet Version: Rev. 3.3, 05/2012; Category: Sensors,Transducers; Datasheet URL: http://datasheet.octopart.com/MPU-6050-InvenSense-datasheet-14421344.pdf; Family: Multifunction; Standard Package: 5,000; Manufacturer URL: http://www.invensense.com/; Output Type: Digital; Dynamic Catalog: MPU-6000™Series
U6 = CMP-2000-04990-2: SENSOR CURRENT HALL 30A AC/DC; Bandwidth: 80kHz; Max Supply Current: 13mA; Linearity: 1.5%; Operating Supply Voltage: 5V; Quiescent Current: 10mA; Number of Channels: 1; Polarity: Bidirectional; Min Supply Voltage: 4.5V; Response Time: 5us; Sensitivity: 66mV/A; Max Supply Voltage: 5.5V; Current Sensing: 30A; REACH SVHC: No SVHC; Mount: Surface Mount; Max Operating Temperature: 85°C; Packaging: Cut Tape; Frequency: 80kHz; Series: -; Termination: SMD/SMT; RoHS Compliant: Yes; Number of Pins: 8; Package Quantity: 1; Accuracy: 1.5%; Lead Free: Lead Free; Case/Package: SOIC; Min Operating Temperature: -40°C; Output Current: 10mA
U7 = CMP-06355-000002-1: Manufacturer: Microchip; Standoff Height: 0mm; Min Supply Voltage: 1.7V; Interface: I2C,2-Wire,SMBus; Sensor Output: I2C,SMBus,Other; Max Supply Voltage: 5.5V; Resolution: 9-12bits; Operating Supply Current: 60-610uA; Automotive: No; Device Class L2: Temperature and Humidity Sensors; Height: 0.6mm; RoHS: TRUE; ComponentLink2Description: Datasheet; Package: 8MA2; Category: IC; Octopart: https://octopart.com/at30ts74-ma8m-t-microchip-77758295; Device Class L3: unset; ComponentLink2URL: http://ww1.microchip.com/downloads/en/DeviceDoc/Web_AT30TS74_0217.pdf; Ipc Land Pattern Name: DFN200X300X55-8; Temperature Range Low: -55°C; Mouser Description: Digital Temperature Sensor, 9- to 12-BIT Selectable, Single 1.7V to 5.5V Supply; Footprint Url: https://ww1.microchip.com/downloads/en/AppNotes/Atmel-8826-SEEPROM-PCB-Mounting-Guidelines-Surface-Mount-Packages-ApplicationNote.pdf; Temperature Range High: +125°C; Temperature: -55°C to +125°C; Device Class L1: Sensors; Digikey Description: AT30TS74-MA8M-T; Lead Free: Yes; Manufacturer Part Number: AT30TS74-MA8M-T
U8 = RFM95W-868S2: Mod Txrx Lora +20dbm 868mhz Smd; Value: *; MP: RFM95W-868S2; Availability: Unavailable; Package: None; Price: None
U? = CMP-0321-00344-2: Low Dropout Linear 2-Cell Li-Ion Charge Controller with AutoCompTM, 8.4 V, 4.5 V, -20 to 70 degC, 8-pin SOIC (D), Green (RoHS & no Sb/Br); Manufacturer: Texas Instruments; Over Voltage Protection: N; SubFamily: Battery Charge Management; Vin(Min)(V): 4.5; Li-Polymer: Y; Mounting Technology: Surface Mount; PackageDescription: 8-Pin Plastic Small Outline Integrated Circuit, 4.9 x 3.9 mm, Pitch 1.27 mm Pitch; NiCd: N; ComponentLink1Description: Datasheet; PackageVersion: revM, Jun-2011; Eco-Plan: Green (RoHS & no Sb/Br); ComponentLink1URL: http://www.ti.com/general/docs/lit/getliterature.tsp?genericPartNumber=BQ2057W&fileType=pdf; NiMH: N; Code_JEDEC: MS-012AA; Lead Acid: N; PackageReference: D0008A; PartNumber: BQ2057WSN; Li-Ion: Y; DatasheetVersion: SLUS025F